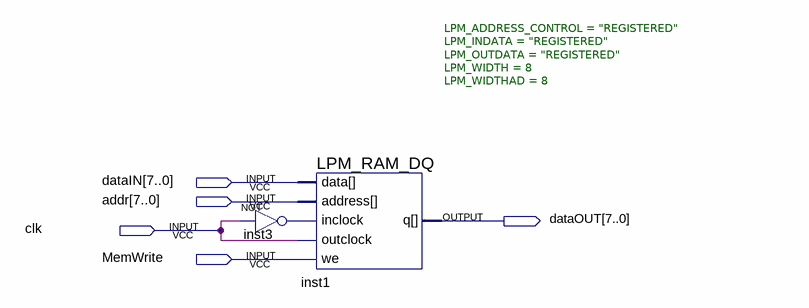
[diagram p0: schematic sheet]
// Quartus schematic Dmem.bdf as structural Verilog: 2 symbols, 5 pins
module Dmem (
  input  [7:0] dataIN,
  input  [7:0] addr,
  input  clk,
  input  MemWrite,
  output [7:0] dataOUT
);

  wire inst3_out;

  not inst3 (inst3_out, clk);
  LPM_RAM_DQ #(.LPM_ADDRESS_CONTROL("REGISTERED"), .LPM_INDATA("REGISTERED"), .LPM_OUTDATA("REGISTERED"), .LPM_WIDTH(8), .LPM_WIDTHAD(8)) inst1 (
    .inclock(inst3_out), .data(dataIN), .address(addr), .we(MemWrite), .outclock(clk), .q(dataOUT));
endmodule
